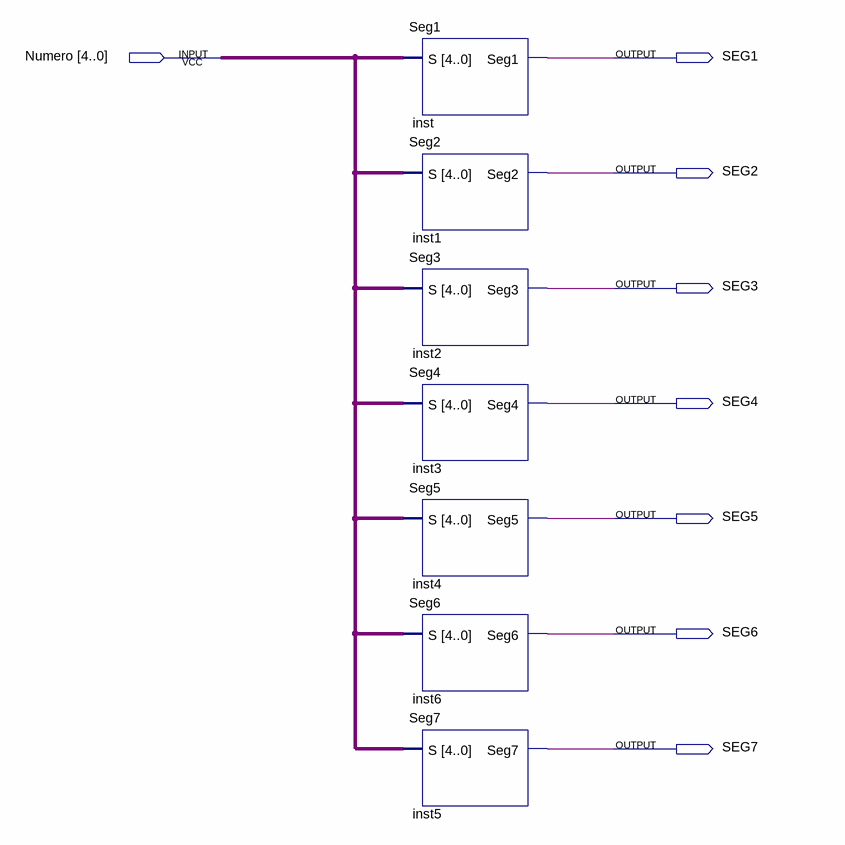
[diagram p0: schematic sheet]
// Quartus schematic Display_Unidades.bdf as structural Verilog: 7 symbols, 8 pins
module Display_Unidades (
  input  [4:0] Numero,
  output SEG1,
  output SEG2,
  output SEG3,
  output SEG4,
  output SEG5,
  output SEG6,
  output SEG7
);

  Seg1 inst (.S(Numero), .Seg1(SEG1));
  Seg2 inst1 (.S(Numero), .Seg2(SEG2));
  Seg3 inst2 (.S(Numero), .Seg3(SEG3));
  Seg4 inst3 (.S(Numero), .Seg4(SEG4));
  Seg5 inst4 (.S(Numero), .Seg5(SEG5));
  Seg6 inst6 (.S(Numero), .Seg6(SEG6));
  Seg7 inst5 (.S(Numero), .Seg7(SEG7));
endmodule
